# EAGLE schematic board-newparts (EAGLE 9.5.2)
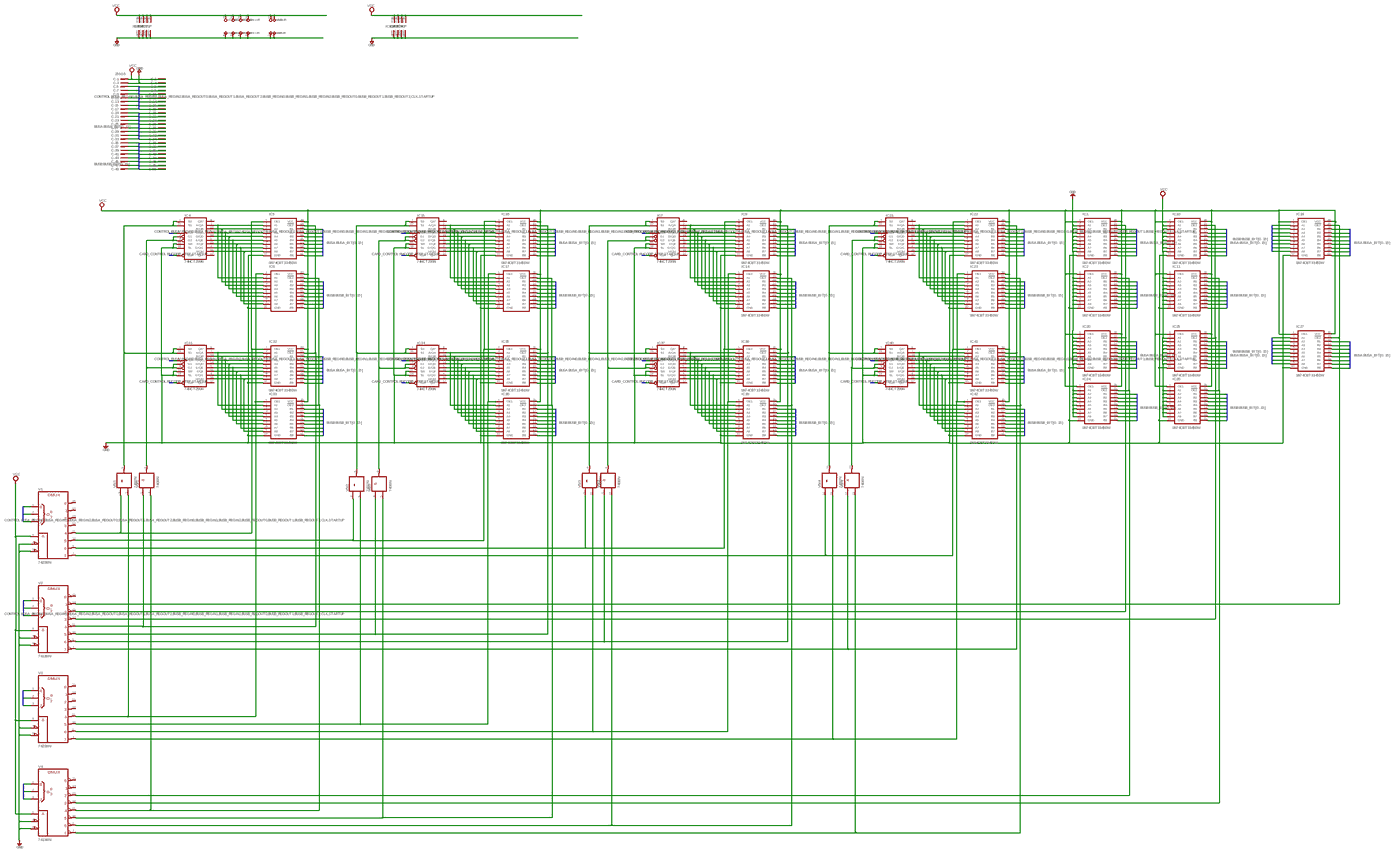
[diagram p0: schematic, sheet 1, overview]
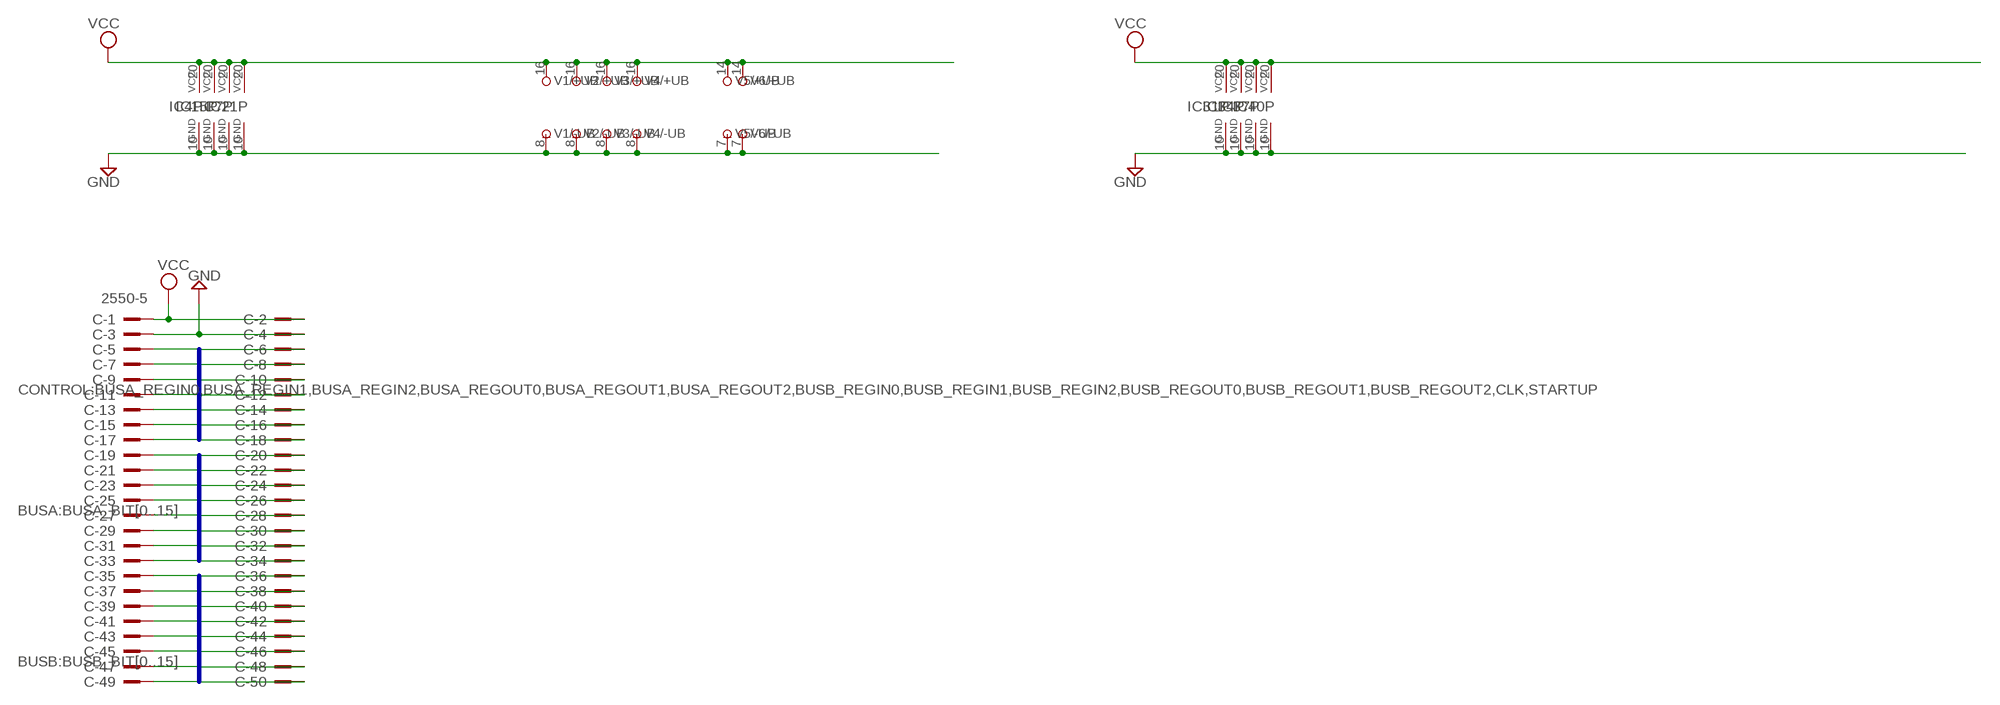
[diagram p1: schematic, sheet 1, part 1 of 4]
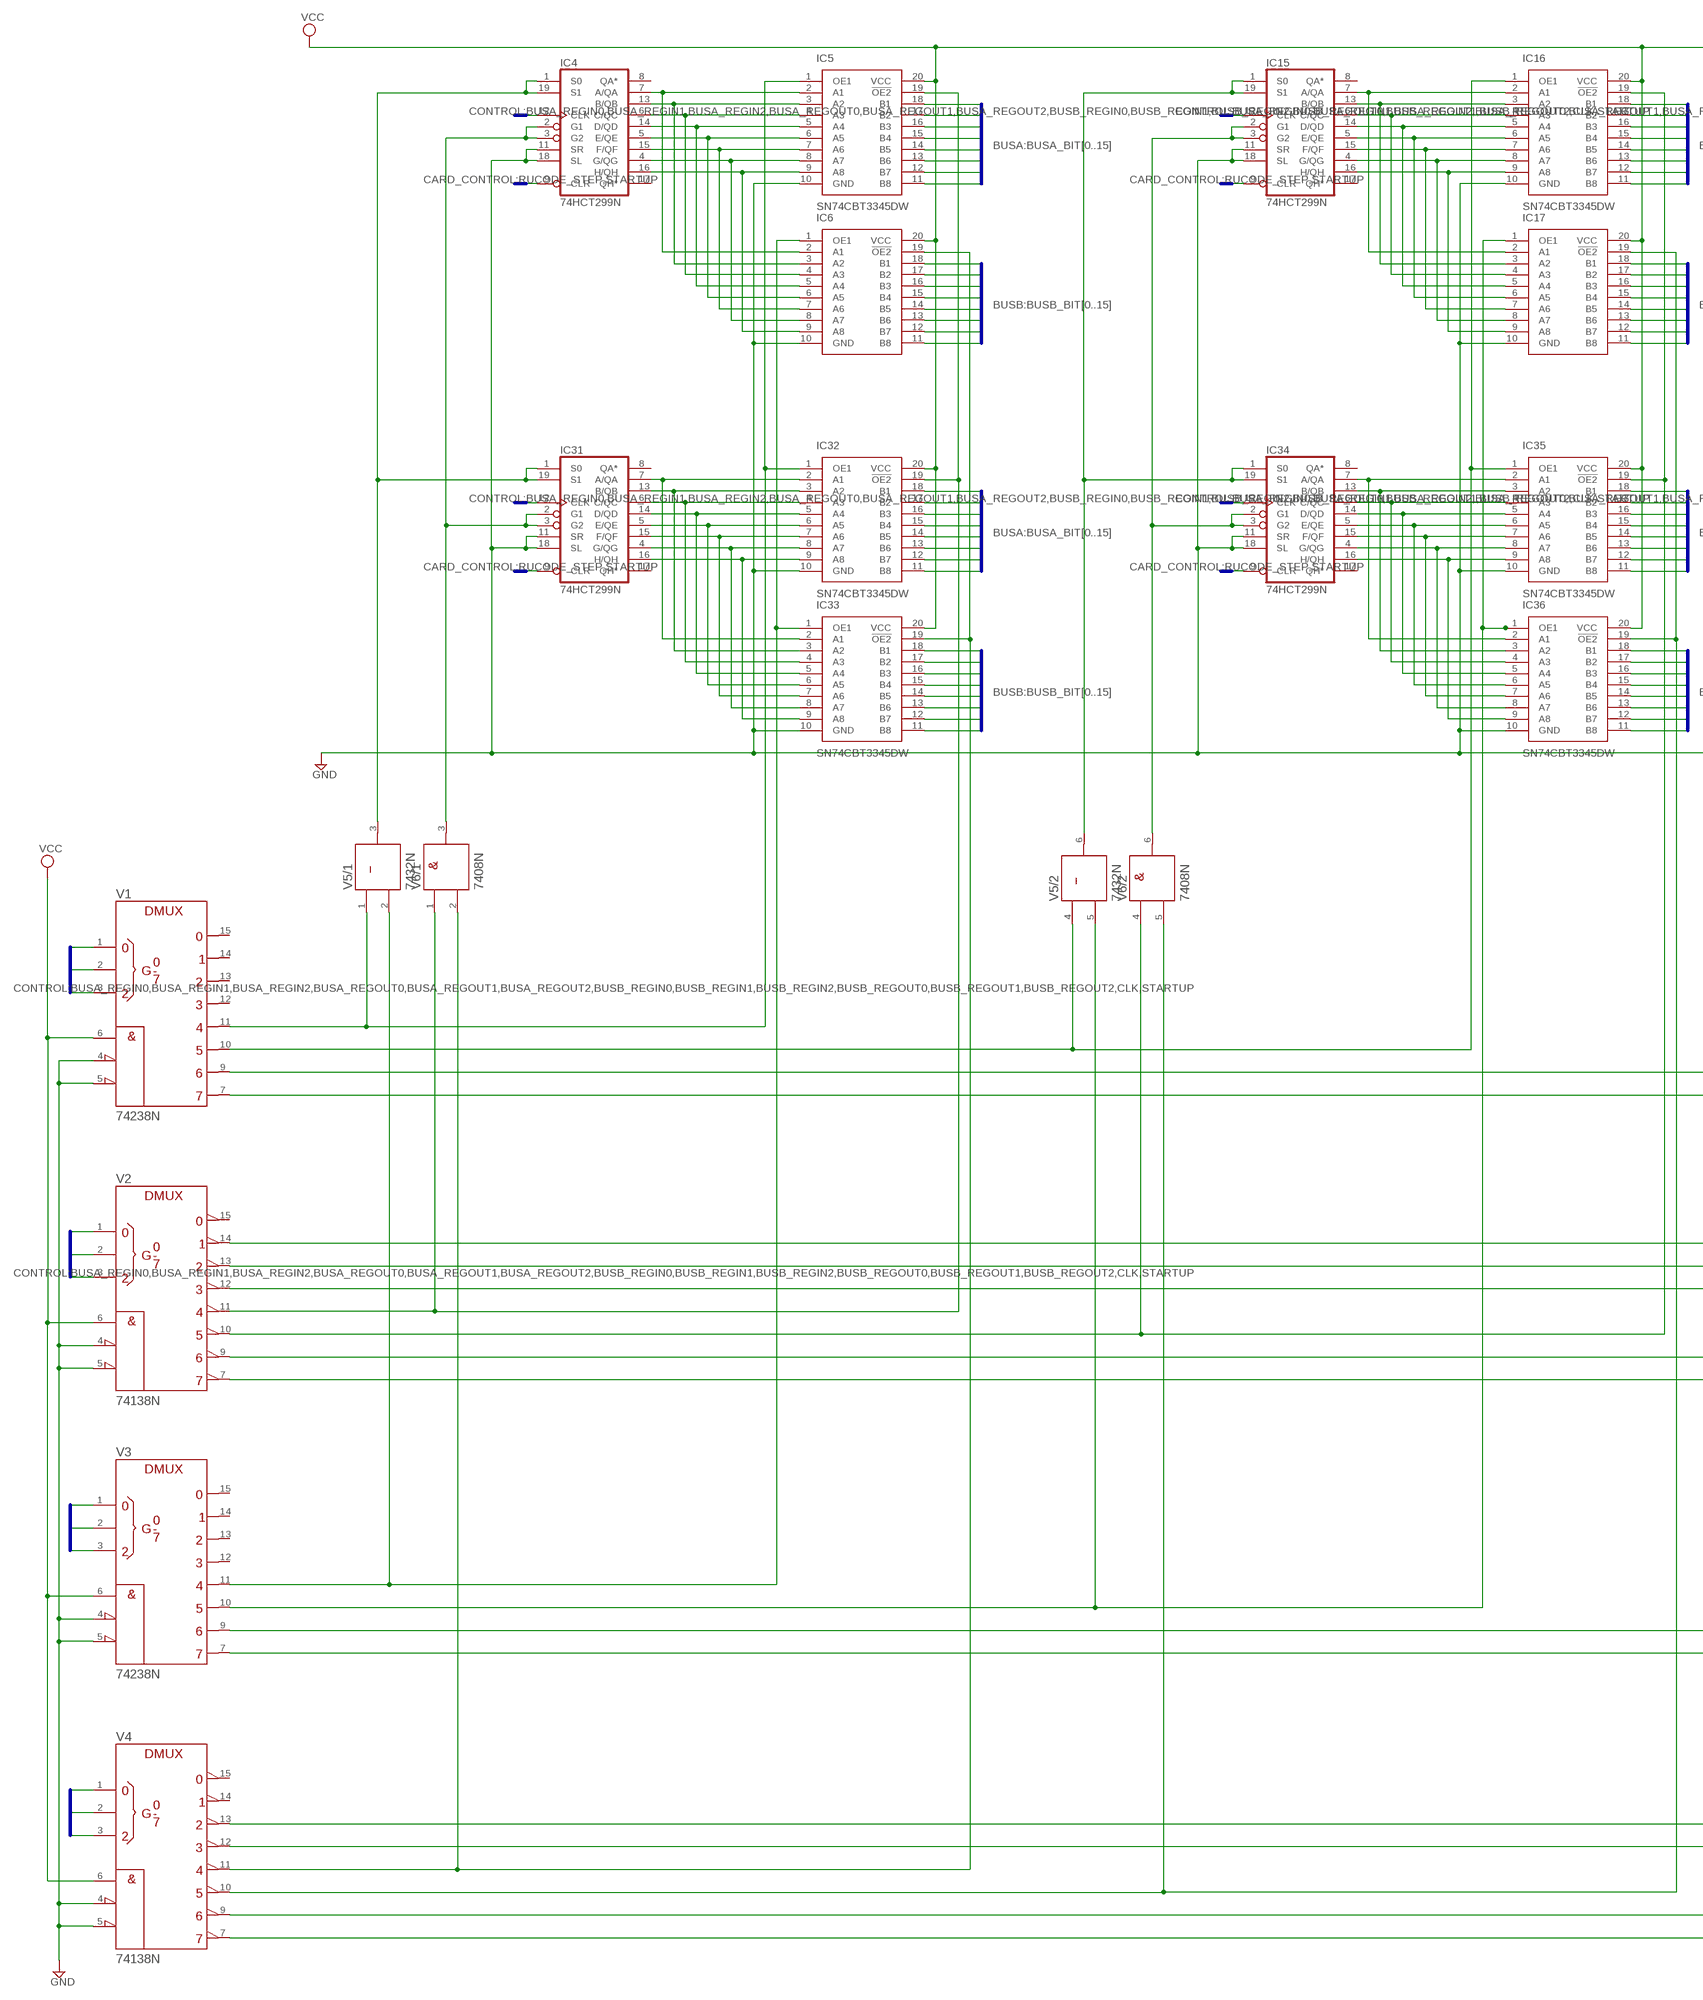
[diagram p2: schematic, sheet 1, part 2 of 4]
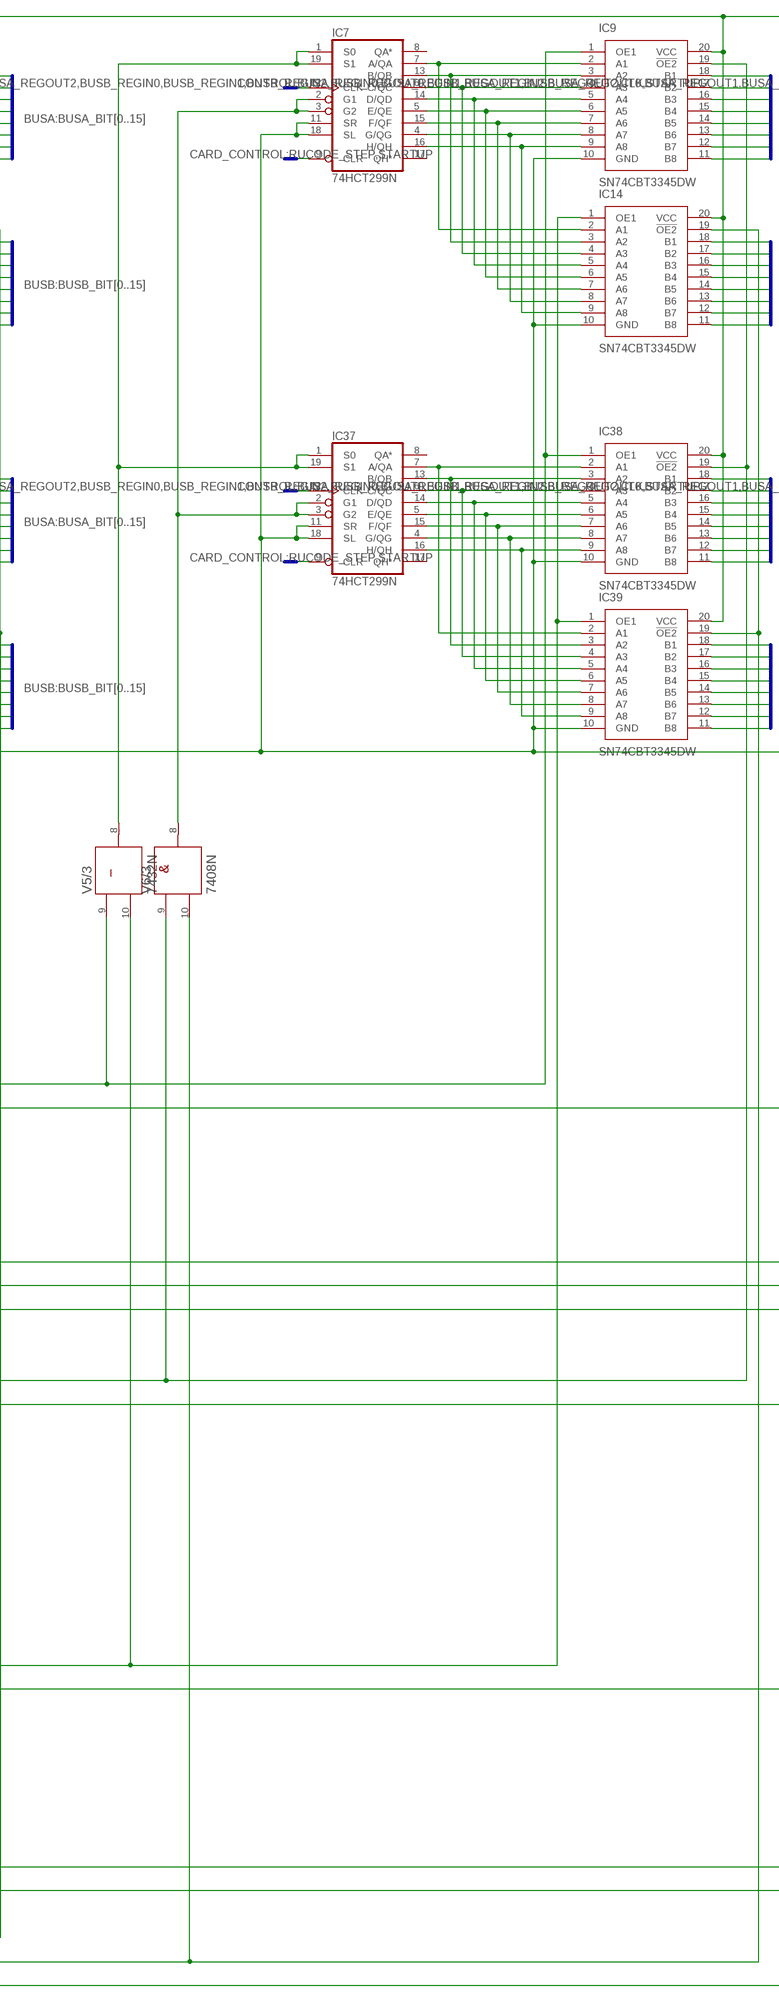
[diagram p3: schematic, sheet 1, part 3 of 4]
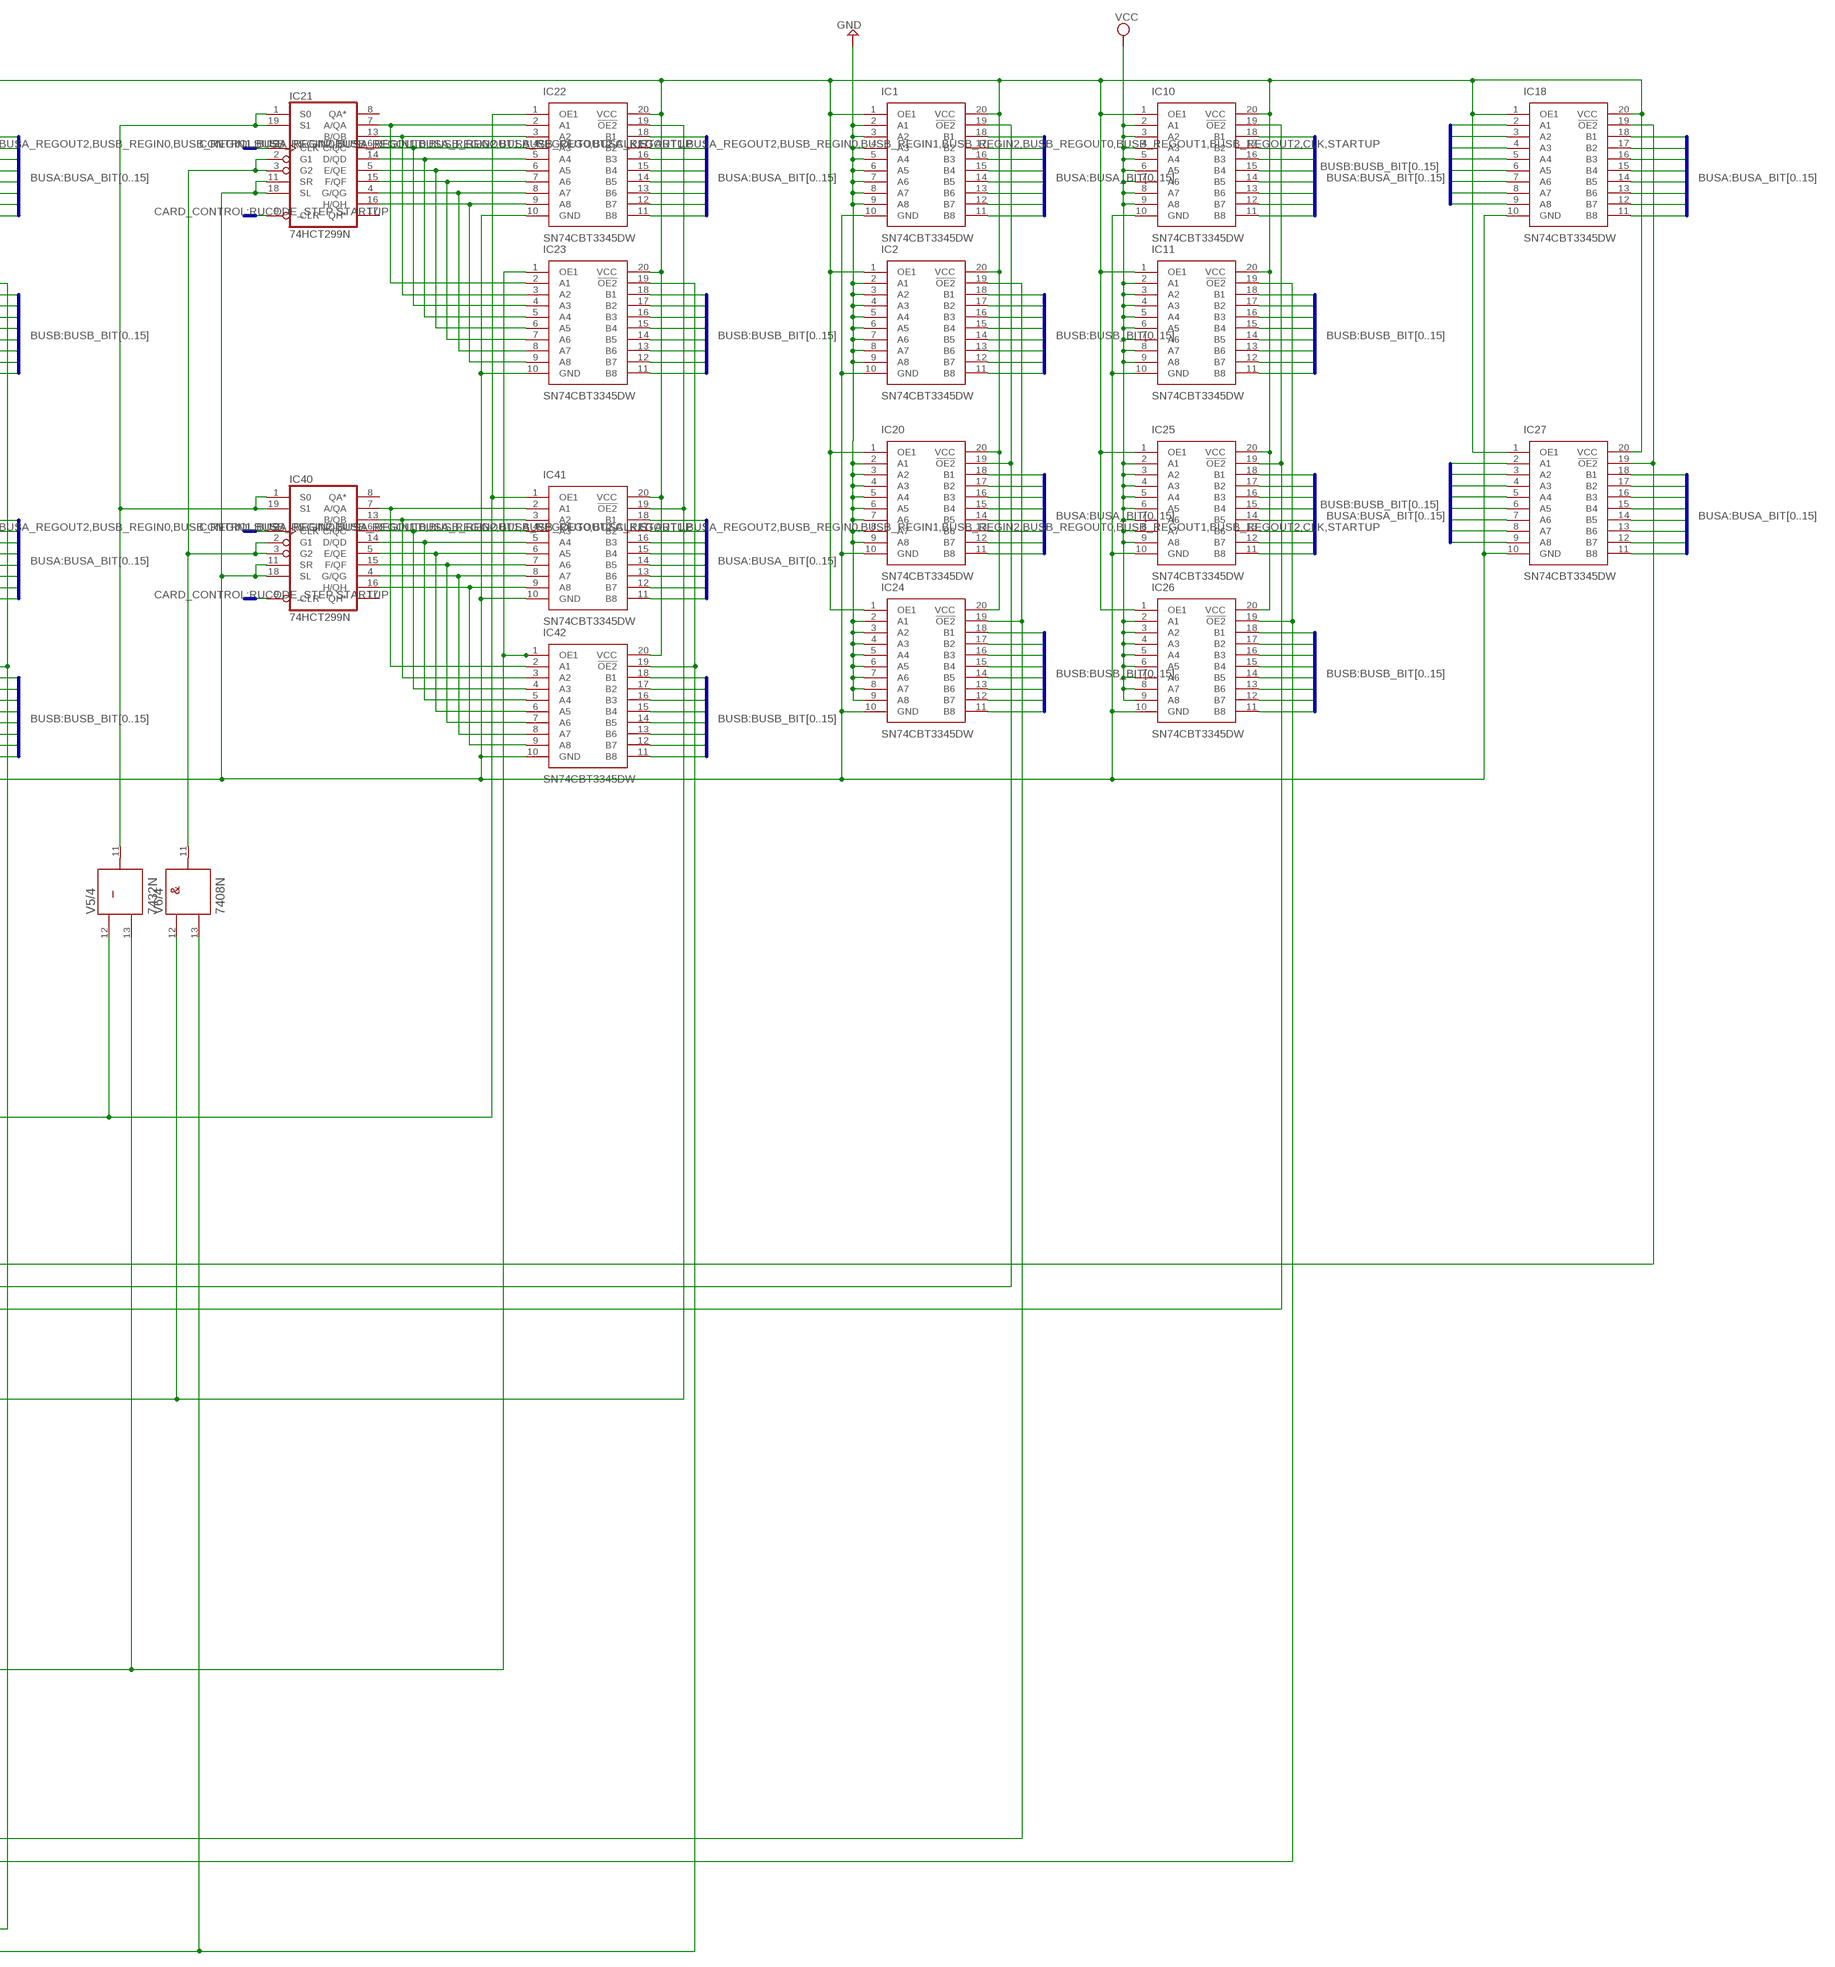
[diagram p4: schematic, sheet 1, part 4 of 4]

## Parts
C  2550-5  [PAK100/2500-5-50]
IC1  SN74CBT3345DW  [SOIC127P1030X265-20N]
IC2  SN74CBT3345DW  [SOIC127P1030X265-20N]
IC4  74HCT299N  [DIL20]
IC5  SN74CBT3345DW  [SOIC127P1030X265-20N]
IC6  SN74CBT3345DW  [SOIC127P1030X265-20N]
IC7  74HCT299N  [DIL20]
IC9  SN74CBT3345DW  [SOIC127P1030X265-20N]
IC10  SN74CBT3345DW  [SOIC127P1030X265-20N]
IC11  SN74CBT3345DW  [SOIC127P1030X265-20N]
IC14  SN74CBT3345DW  [SOIC127P1030X265-20N]
IC15  74HCT299N  [DIL20]
IC16  SN74CBT3345DW  [SOIC127P1030X265-20N]
IC17  SN74CBT3345DW  [SOIC127P1030X265-20N]
IC18  SN74CBT3345DW  [SOIC127P1030X265-20N]
IC20  SN74CBT3345DW  [SOIC127P1030X265-20N]
IC21  74HCT299N  [DIL20]
IC22  SN74CBT3345DW  [SOIC127P1030X265-20N]
IC23  SN74CBT3345DW  [SOIC127P1030X265-20N]
IC24  SN74CBT3345DW  [SOIC127P1030X265-20N]
IC25  SN74CBT3345DW  [SOIC127P1030X265-20N]
IC26  SN74CBT3345DW  [SOIC127P1030X265-20N]
IC27  SN74CBT3345DW  [SOIC127P1030X265-20N]
IC31  74HCT299N  [DIL20]
IC32  SN74CBT3345DW  [SOIC127P1030X265-20N]
IC33  SN74CBT3345DW  [SOIC127P1030X265-20N]
IC34  74HCT299N  [DIL20]
IC35  SN74CBT3345DW  [SOIC127P1030X265-20N]
IC36  SN74CBT3345DW  [SOIC127P1030X265-20N]
IC37  74HCT299N  [DIL20]
IC38  SN74CBT3345DW  [SOIC127P1030X265-20N]
IC39  SN74CBT3345DW  [SOIC127P1030X265-20N]
IC40  74HCT299N  [DIL20]
IC41  SN74CBT3345DW  [SOIC127P1030X265-20N]
IC42  SN74CBT3345DW  [SOIC127P1030X265-20N]
V1  74238N  [DIL16]
V2  74138N  [DIL16]
V3  74238N  [DIL16]
V4  74138N  [DIL16]
V5  7432N  [DIL14]
V6  7408N  [DIL14]

## Nets
BUSA_BIT0: C.19 IC1.18(B1) IC5.18(B1) IC9.18(B1) IC10.18(B1) IC16.18(B1) IC18.18(B1) IC22.18(B1)
BUSA_BIT1: C.20 IC1.17(B2) IC5.17(B2) IC9.17(B2) IC10.17(B2) IC16.17(B2) IC18.17(B2) IC22.17(B2)
BUSA_BIT2: C.21 IC1.16(B3) IC5.16(B3) IC9.16(B3) IC10.16(B3) IC16.16(B3) IC18.16(B3) IC22.16(B3)
BUSA_BIT3: C.22 IC1.15(B4) IC5.15(B4) IC9.15(B4) IC10.15(B4) IC16.15(B4) IC18.15(B4) IC22.15(B4)
BUSA_BIT4: C.23 IC1.14(B5) IC5.14(B5) IC9.14(B5) IC10.14(B5) IC16.14(B5) IC18.14(B5) IC22.14(B5)
BUSA_BIT5: C.24 IC1.13(B6) IC5.13(B6) IC9.13(B6) IC10.13(B6) IC16.13(B6) IC18.13(B6) IC22.13(B6)
BUSA_BIT6: C.25 IC1.12(B7) IC5.12(B7) IC9.12(B7) IC10.12(B7) IC16.12(B7) IC18.12(B7) IC22.12(B7)
BUSA_BIT7: C.26 IC1.11(B8) IC5.11(B8) IC9.11(B8) IC10.11(B8) IC16.11(B8) IC18.11(B8) IC22.11(B8)
BUSA_BIT8: C.27 IC20.18(B1) IC25.18(B1) IC27.18(B1) IC32.18(B1) IC35.18(B1) IC38.18(B1) IC41.18(B1)
BUSA_BIT9: C.28 IC20.17(B2) IC25.17(B2) IC27.17(B2) IC32.17(B2) IC35.17(B2) IC38.17(B2) IC41.17(B2)
BUSA_BIT10: C.29 IC20.16(B3) IC25.16(B3) IC27.16(B3) IC32.16(B3) IC35.16(B3) IC38.16(B3) IC41.16(B3)
BUSA_BIT11: C.30 IC20.15(B4) IC25.15(B4) IC27.15(B4) IC32.15(B4) IC35.15(B4) IC38.15(B4) IC41.15(B4)
BUSA_BIT12: C.31 IC20.14(B5) IC25.14(B5) IC27.14(B5) IC32.14(B5) IC35.14(B5) IC38.14(B5) IC41.14(B5)
BUSA_BIT13: C.32 IC20.13(B6) IC25.13(B6) IC27.13(B6) IC32.13(B6) IC35.13(B6) IC38.13(B6) IC41.13(B6)
BUSA_BIT14: C.33 IC20.12(B7) IC25.12(B7) IC27.12(B7) IC32.12(B7) IC35.12(B7) IC38.12(B7) IC41.12(B7)
BUSA_BIT15: C.34 IC20.11(B8) IC25.11(B8) IC27.11(B8) IC32.11(B8) IC35.11(B8) IC38.11(B8) IC41.11(B8)
BUSA_REGIN0: C.7 V1.1(A)
BUSA_REGIN1: C.9 V1.2(B)
BUSA_REGIN2: C.11 V1.3(C)
BUSA_REGOUT0: C.13 V2.1(A)
BUSA_REGOUT1: C.15 V2.2(B)
BUSA_REGOUT2: C.17 V2.3(C)
BUSB_BIT0: C.35 IC2.18(B1) IC6.18(B1) IC11.18(B1) IC14.18(B1) IC17.18(B1) IC18.2(A1) IC23.18(B1)
BUSB_BIT1: C.36 IC2.17(B2) IC6.17(B2) IC11.17(B2) IC14.17(B2) IC17.17(B2) IC18.3(A2) IC23.17(B2)
BUSB_BIT2: C.37 IC2.16(B3) IC6.16(B3) IC11.16(B3) IC14.16(B3) IC17.16(B3) IC18.4(A3) IC23.16(B3)
BUSB_BIT3: C.38 IC2.15(B4) IC6.15(B4) IC11.15(B4) IC14.15(B4) IC17.15(B4) IC18.5(A4) IC23.15(B4)
BUSB_BIT4: C.39 IC2.14(B5) IC6.14(B5) IC11.14(B5) IC14.14(B5) IC17.14(B5) IC18.6(A5) IC23.14(B5)
BUSB_BIT5: C.40 IC2.13(B6) IC6.13(B6) IC11.13(B6) IC14.13(B6) IC17.13(B6) IC18.7(A6) IC23.13(B6)
BUSB_BIT6: C.41 IC2.12(B7) IC6.12(B7) IC11.12(B7) IC14.12(B7) IC17.12(B7) IC18.8(A7) IC23.12(B7)
BUSB_BIT7: C.42 IC2.11(B8) IC6.11(B8) IC11.11(B8) IC14.11(B8) IC17.11(B8) IC18.9(A8) IC23.11(B8)
BUSB_BIT8: C.43 IC24.18(B1) IC26.18(B1) IC27.2(A1) IC33.18(B1) IC36.18(B1) IC39.18(B1) IC42.18(B1)
BUSB_BIT9: C.44 IC24.17(B2) IC26.17(B2) IC27.3(A2) IC33.17(B2) IC36.17(B2) IC39.17(B2) IC42.17(B2)
BUSB_BIT10: C.45 IC24.16(B3) IC26.16(B3) IC27.4(A3) IC33.16(B3) IC36.16(B3) IC39.16(B3) IC42.16(B3)
BUSB_BIT11: C.46 IC24.15(B4) IC26.15(B4) IC27.5(A4) IC33.15(B4) IC36.15(B4) IC39.15(B4) IC42.15(B4)
BUSB_BIT12: C.47 IC24.14(B5) IC26.14(B5) IC27.6(A5) IC33.14(B5) IC36.14(B5) IC39.14(B5) IC42.14(B5)
BUSB_BIT13: C.48 IC24.13(B6) IC26.13(B6) IC27.7(A6) IC33.13(B6) IC36.13(B6) IC39.13(B6) IC42.13(B6)
BUSB_BIT14: C.49 IC24.12(B7) IC26.12(B7) IC27.8(A7) IC33.12(B7) IC36.12(B7) IC39.12(B7) IC42.12(B7)
BUSB_BIT15: C.50 IC24.11(B8) IC26.11(B8) IC27.9(A8) IC33.11(B8) IC36.11(B8) IC39.11(B8) IC42.11(B8)
BUSB_REGIN0: C.8 V3.1(A)
BUSB_REGIN1: C.10 V3.2(B)
BUSB_REGIN2: C.12 V3.3(C)
BUSB_REGOUT0: C.14 V4.1(A)
BUSB_REGOUT1: C.16 V4.2(B)
BUSB_REGOUT2: C.18 V4.3(C)
CLK: C.5 IC4.12(CLK) IC7.12(CLK) IC15.12(CLK) IC21.12(CLK) IC31.12(CLK) IC34.12(CLK) IC37.12(CLK) IC40.12(CLK)
GND: C.3 C.4 IC1.2(A1) IC1.3(A2) IC1.4(A3) IC1.5(A4) IC1.6(A5) IC1.7(A6) IC1.8(A7) IC1.9(A8) IC1.10(GND) IC2.2(A1) IC2.3(A2) IC2.4(A3) IC2.5(A4) IC2.6(A5) IC2.7(A6) IC2.8(A7) IC2.9(A8) IC2.10(GND) IC4.10(GND) IC4.11(SR) IC4.18(SL) IC5.10(GND) IC6.10(GND) IC7.10(GND) IC7.11(SR) IC7.18(SL) IC9.10(GND) IC10.10(GND) IC11.10(GND) IC14.10(GND) IC15.10(GND) IC15.11(SR) IC15.18(SL) IC16.10(GND) IC17.10(GND) IC18.10(GND) IC20.2(A1) IC20.3(A2) IC20.4(A3) IC20.5(A4) IC20.6(A5) IC20.7(A6) IC20.8(A7) IC20.9(A8) IC20.10(GND) IC21.10(GND) IC21.11(SR) IC21.18(SL) IC22.10(GND) IC23.10(GND) IC24.2(A1) IC24.3(A2) IC24.4(A3) IC24.5(A4) IC24.6(A5) IC24.7(A6) IC24.8(A7) IC24.9(A8) IC24.10(GND) IC25.10(GND) IC26.10(GND) IC27.10(GND) IC31.10(GND) IC31.11(SR) IC31.18(SL) IC32.10(GND) IC33.10(GND) IC34.10(GND) IC34.11(SR) IC34.18(SL) IC35.10(GND) IC36.10(GND) IC37.10(GND) IC37.11(SR) IC37.18(SL) IC38.10(GND) IC39.10(GND) IC40.10(GND) IC40.11(SR) IC40.18(SL) IC41.10(GND) IC42.10(GND) V1.4(!G2A) V1.5(!G2B) V1.8(-UB) V2.4(!G2A) V2.5(!G2B) V2.8(-UB) V3.4(!G2A) V3.5(!G2B) V3.8(-UB) V4.4(!G2A) V4.5(!G2B) V4.8(-UB) V5.7(/-UB:-UB) V6.7(/-UB:-UB)
N$1: IC34.16(H/QH) IC35.9(A8) IC36.9(A8)
N$2: IC16.1(OE1) IC35.1(OE1) V1.10(Y5) V5.4(/2:A)
N$3: IC16.19(!OE2) IC35.19(!OE2) V2.10(Y5) V6.4(/2:A)
N$4: IC4.2(G1) IC4.3(G2) IC31.2(G1) IC31.3(G2) V6.3(/1:Y)
N$5: IC4.7(A/QA) IC5.2(A1) IC6.2(A1)
N$6: IC4.13(B/QB) IC5.3(A2) IC6.3(A2)
N$7: IC4.6(C/QC) IC5.4(A3) IC6.4(A3)
N$8: IC4.14(D/QD) IC5.5(A4) IC6.5(A4)
N$9: IC4.5(E/QE) IC5.6(A5) IC6.6(A5)
N$10: IC4.15(F/QF) IC5.7(A6) IC6.7(A6)
N$11: IC4.4(G/QG) IC5.8(A7) IC6.8(A7)
N$12: IC5.1(OE1) IC32.1(OE1) V1.11(Y4) V5.1(/1:A)
N$13: IC10.19(!OE2) IC25.19(!OE2) V2.12(Y3)
N$14: IC5.19(!OE2) IC32.19(!OE2) V2.11(Y4) V6.1(/1:A)
N$15: IC4.16(H/QH) IC5.9(A8) IC6.9(A8)
N$17: IC6.19(!OE2) IC33.19(!OE2) V4.11(Y4) V6.2(/1:B)
N$18: IC15.1(S0) IC15.19(S1) IC34.1(S0) IC34.19(S1) V5.6(/2:Y)
N$19: IC15.2(G1) IC15.3(G2) IC34.2(G1) IC34.3(G2) V6.6(/2:Y)
N$20: IC4.1(S0) IC4.19(S1) IC31.1(S0) IC31.19(S1) V5.3(/1:Y)
N$22: IC7.7(A/QA) IC9.2(A1) IC14.2(A1)
N$23: IC7.13(B/QB) IC9.3(A2) IC14.3(A2)
N$24: IC7.6(C/QC) IC9.4(A3) IC14.4(A3)
N$25: IC7.14(D/QD) IC9.5(A4) IC14.5(A4)
N$26: IC17.1(OE1) IC36.1(OE1) V3.10(Y5) V5.5(/2:B)
N$27: IC17.19(!OE2) IC36.19(!OE2) V4.10(Y5) V6.5(/2:B)
N$28: IC7.5(E/QE) IC9.6(A5) IC14.6(A5)
N$29: IC14.1(OE1) IC39.1(OE1) V3.9(Y6) V5.10(/3:B)
N$30: IC7.1(S0) IC7.19(S1) IC37.1(S0) IC37.19(S1) V5.8(/3:Y)
N$31: IC7.2(G1) IC7.3(G2) IC37.2(G1) IC37.3(G2) V6.8(/3:Y)
N$32: IC23.1(OE1) IC42.1(OE1) V3.7(Y7) V5.13(/4:B)
N$33: IC9.1(OE1) IC38.1(OE1) V1.9(Y6) V5.9(/3:A)
N$34: IC9.19(!OE2) IC38.19(!OE2) V2.9(Y6) V6.9(/3:A)
N$35: IC7.15(F/QF) IC9.7(A6) IC14.7(A6)
N$36: IC7.4(G/QG) IC9.8(A7) IC14.8(A7)
N$37: IC7.16(H/QH) IC9.9(A8) IC14.9(A8)
N$39: IC1.19(!OE2) IC20.19(!OE2) V2.13(Y2)
N$40: IC14.19(!OE2) IC39.19(!OE2) V4.9(Y6) V6.10(/3:B)
N$41: IC15.7(A/QA) IC16.2(A1) IC17.2(A1)
N$42: IC15.13(B/QB) IC16.3(A2) IC17.3(A2)
N$43: IC15.6(C/QC) IC16.4(A3) IC17.4(A3)
N$44: IC15.14(D/QD) IC16.5(A4) IC17.5(A4)
N$45: IC15.5(E/QE) IC16.6(A5) IC17.6(A5)
N$46: IC15.15(F/QF) IC16.7(A6) IC17.7(A6)
N$47: IC15.4(G/QG) IC16.8(A7) IC17.8(A7)
N$48: IC15.16(H/QH) IC16.9(A8) IC17.9(A8)
N$50: IC21.1(S0) IC21.19(S1) IC40.1(S0) IC40.19(S1) V5.11(/4:Y)
N$51: IC22.1(OE1) IC41.1(OE1) V1.7(Y7) V5.12(/4:A)
N$52: IC23.19(!OE2) IC42.19(!OE2) V4.7(Y7) V6.13(/4:B)
N$54: IC18.19(!OE2) IC27.19(!OE2) V2.14(Y1)
N$55: IC22.19(!OE2) IC41.19(!OE2) V2.7(Y7) V6.12(/4:A)
N$58: IC11.19(!OE2) IC26.19(!OE2) V4.12(Y3)
N$61: IC2.19(!OE2) IC24.19(!OE2) V4.13(Y2)
N$63: IC21.7(A/QA) IC22.2(A1) IC23.2(A1)
N$64: IC21.13(B/QB) IC22.3(A2) IC23.3(A2)
N$65: IC21.6(C/QC) IC22.4(A3) IC23.4(A3)
N$66: IC21.14(D/QD) IC22.5(A4) IC23.5(A4)
N$67: IC21.5(E/QE) IC22.6(A5) IC23.6(A5)
N$68: IC21.15(F/QF) IC22.7(A6) IC23.7(A6)
N$69: IC21.4(G/QG) IC22.8(A7) IC23.8(A7)
N$70: IC21.16(H/QH) IC22.9(A8) IC23.9(A8)
N$121: IC31.7(A/QA) IC32.2(A1) IC33.2(A1)
N$122: IC31.13(B/QB) IC32.3(A2) IC33.3(A2)
N$125: IC31.6(C/QC) IC32.4(A3) IC33.4(A3)
N$126: IC31.14(D/QD) IC32.5(A4) IC33.5(A4)
N$129: IC31.5(E/QE) IC32.6(A5) IC33.6(A5)
N$130: IC31.15(F/QF) IC32.7(A6) IC33.7(A6)
N$131: IC31.4(G/QG) IC32.8(A7) IC33.8(A7)
N$132: IC31.16(H/QH) IC32.9(A8) IC33.9(A8)
N$133: IC34.7(A/QA) IC35.2(A1) IC36.2(A1)
N$134: IC34.13(B/QB) IC35.3(A2) IC36.3(A2)
N$135: IC34.6(C/QC) IC35.4(A3) IC36.4(A3)
N$136: IC34.14(D/QD) IC35.5(A4) IC36.5(A4)
N$139: IC34.5(E/QE) IC35.6(A5) IC36.6(A5)
N$140: IC34.15(F/QF) IC35.7(A6) IC36.7(A6)
N$141: IC34.4(G/QG) IC35.8(A7) IC36.8(A7)
N$143: IC37.7(A/QA) IC38.2(A1) IC39.2(A1)
N$144: IC37.13(B/QB) IC38.3(A2) IC39.3(A2)
N$145: IC37.6(C/QC) IC38.4(A3) IC39.4(A3)
N$146: IC37.14(D/QD) IC38.5(A4) IC39.5(A4)
N$149: IC37.5(E/QE) IC38.6(A5) IC39.6(A5)
N$150: IC37.15(F/QF) IC38.7(A6) IC39.7(A6)
N$151: IC37.4(G/QG) IC38.8(A7) IC39.8(A7)
N$152: IC37.16(H/QH) IC38.9(A8) IC39.9(A8)
N$153: IC40.7(A/QA) IC41.2(A1) IC42.2(A1)
N$154: IC40.13(B/QB) IC41.3(A2) IC42.3(A2)
N$155: IC40.6(C/QC) IC41.4(A3) IC42.4(A3)
N$156: IC40.14(D/QD) IC41.5(A4) IC42.5(A4)
N$157: IC21.2(G1) IC21.3(G2) IC40.2(G1) IC40.3(G2) V6.11(/4:Y)
N$159: IC40.5(E/QE) IC41.6(A5) IC42.6(A5)
N$160: IC40.15(F/QF) IC41.7(A6) IC42.7(A6)
N$161: IC40.4(G/QG) IC41.8(A7) IC42.8(A7)
N$162: IC40.16(H/QH) IC41.9(A8) IC42.9(A8)
N$163: IC6.1(OE1) IC33.1(OE1) V3.11(Y4) V5.2(/1:B)
STARTUP: C.6 IC4.9(CLR) IC7.9(CLR) IC15.9(CLR) IC21.9(CLR) IC31.9(CLR) IC34.9(CLR) IC37.9(CLR) IC40.9(CLR)
VCC: C.1 C.2 IC1.1(OE1) IC1.20(VCC) IC2.1(OE1) IC2.20(VCC) IC4.20(VCC) IC5.20(VCC) IC6.20(VCC) IC7.20(VCC) IC9.20(VCC) IC10.1(OE1) IC10.2(A1) IC10.3(A2) IC10.4(A3) IC10.5(A4) IC10.6(A5) IC10.7(A6) IC10.8(A7) IC10.9(A8) IC10.20(VCC) IC11.1(OE1) IC11.2(A1) IC11.3(A2) IC11.4(A3) IC11.5(A4) IC11.6(A5) IC11.7(A6) IC11.8(A7) IC11.9(A8) IC11.20(VCC) IC14.20(VCC) IC15.20(VCC) IC16.20(VCC) IC17.20(VCC) IC18.1(OE1) IC18.20(VCC) IC20.1(OE1) IC20.20(VCC) IC21.20(VCC) IC22.20(VCC) IC23.20(VCC) IC24.1(OE1) IC24.20(VCC) IC25.1(OE1) IC25.2(A1) IC25.3(A2) IC25.4(A3) IC25.5(A4) IC25.6(A5) IC25.7(A6) IC25.8(A7) IC25.9(A8) IC25.20(VCC) IC26.1(OE1) IC26.2(A1) IC26.3(A2) IC26.4(A3) IC26.5(A4) IC26.6(A5) IC26.7(A6) IC26.8(A7) IC26.9(A8) IC26.20(VCC) IC27.1(OE1) IC27.20(VCC) IC31.20(VCC) IC32.20(VCC) IC33.20(VCC) IC34.20(VCC) IC35.20(VCC) IC36.20(VCC) IC37.20(VCC) IC38.20(VCC) IC39.20(VCC) IC40.20(VCC) IC41.20(VCC) IC42.20(VCC) V1.6(G1) V1.16(+UB) V2.6(G1) V2.16(+UB) V3.6(G1) V3.16(+UB) V4.6(G1) V4.16(+UB) V5.14(/+UB:+UB) V6.14(/+UB:+UB)
Unconnected: IC4.8(QA*) IC4.17(QH*) IC7.8(QA*) IC7.17(QH*) IC15.8(QA*) IC15.17(QH*) IC21.8(QA*) IC21.17(QH*) IC31.8(QA*) IC31.17(QH*) IC34.8(QA*) IC34.17(QH*) IC37.8(QA*) IC37.17(QH*) IC40.8(QA*) IC40.17(QH*) V1.12(Y3) V1.13(Y2) V1.14(Y1) V1.15(Y0) V2.15(Y0) V3.12(Y3) V3.13(Y2) V3.14(Y1) V3.15(Y0) V4.14(Y1) V4.15(Y0)

## Buses
CONTROL:BUSA_REGIN0,BUSA_REGIN1,BUSA_REGIN2,BUSA_REGOUT0,BUSA_REGOUT1,BUSA_REGOUT2,BUSB_REGIN0,BUSB_REGIN1,BUSB_REGIN2,BUSB_REGOUT0,BUSB_REGOUT1,BUSB_REGOUT2,CLK,STARTUP
CARD_CONTROL:RUCODE_STEP,STARTUP
BUSA:BUSA_BIT[0..15]
BUSB:BUSB_BIT[0..15]

## Library data of the parts
C = con-3m:2550-: 3M (TM) Pak 100 4-Wall Header Source: 3M; OC_FARNELL: 1788696; OC_NEWARK: unknown
IC1 IC2 IC5 IC6 IC9-IC11 IC14 IC16-IC18 IC20 IC22-IC27 IC32 IC33 IC35 IC36 IC38 IC39 IC41 IC42 = SamacSys_Parts:SN74CBT3345DW: Texas Instruments SN74CBT3345DW, Bus Switch, 8 x 1:1, 4.5 5.5 V, 20-Pin SOIC Source: Datasheet <https://www.ti.com/lit/ds/symlink/sn74cbt3345.pdf>; DESCRIPTION: Texas Instruments SN74CBT3345DW, Bus Switch, 8 x 1:1, 4.5 5.5 V, 20-Pin SOIC; HEIGHT: 2.65mm; MANUFACTURER_NAME: Texas Instruments; MANUFACTURER_PART_NUMBER: SN74CBT3345DW
IC4 IC7 IC15 IC21 IC31 IC34 IC37 IC40 = 74xx-eu:74*299: 8-bit universal SHIFT/STORAGE REGISTER
V1 V3 = 74ttl-din:74*238: 1 of 8 noninverting DECODER/DEMULTIPLEXER
V2 V4 = 74ttl-din:74*138: 3-line to 8-line DECODER/DEMULTIPLEXER
V5 = 74ttl-din:74*32: Quad 2-input OR gate
V6 = 74ttl-din:74*08: Quad 2-input AND gate